# Altium project Arduino_Project_Altium.PrjPcb
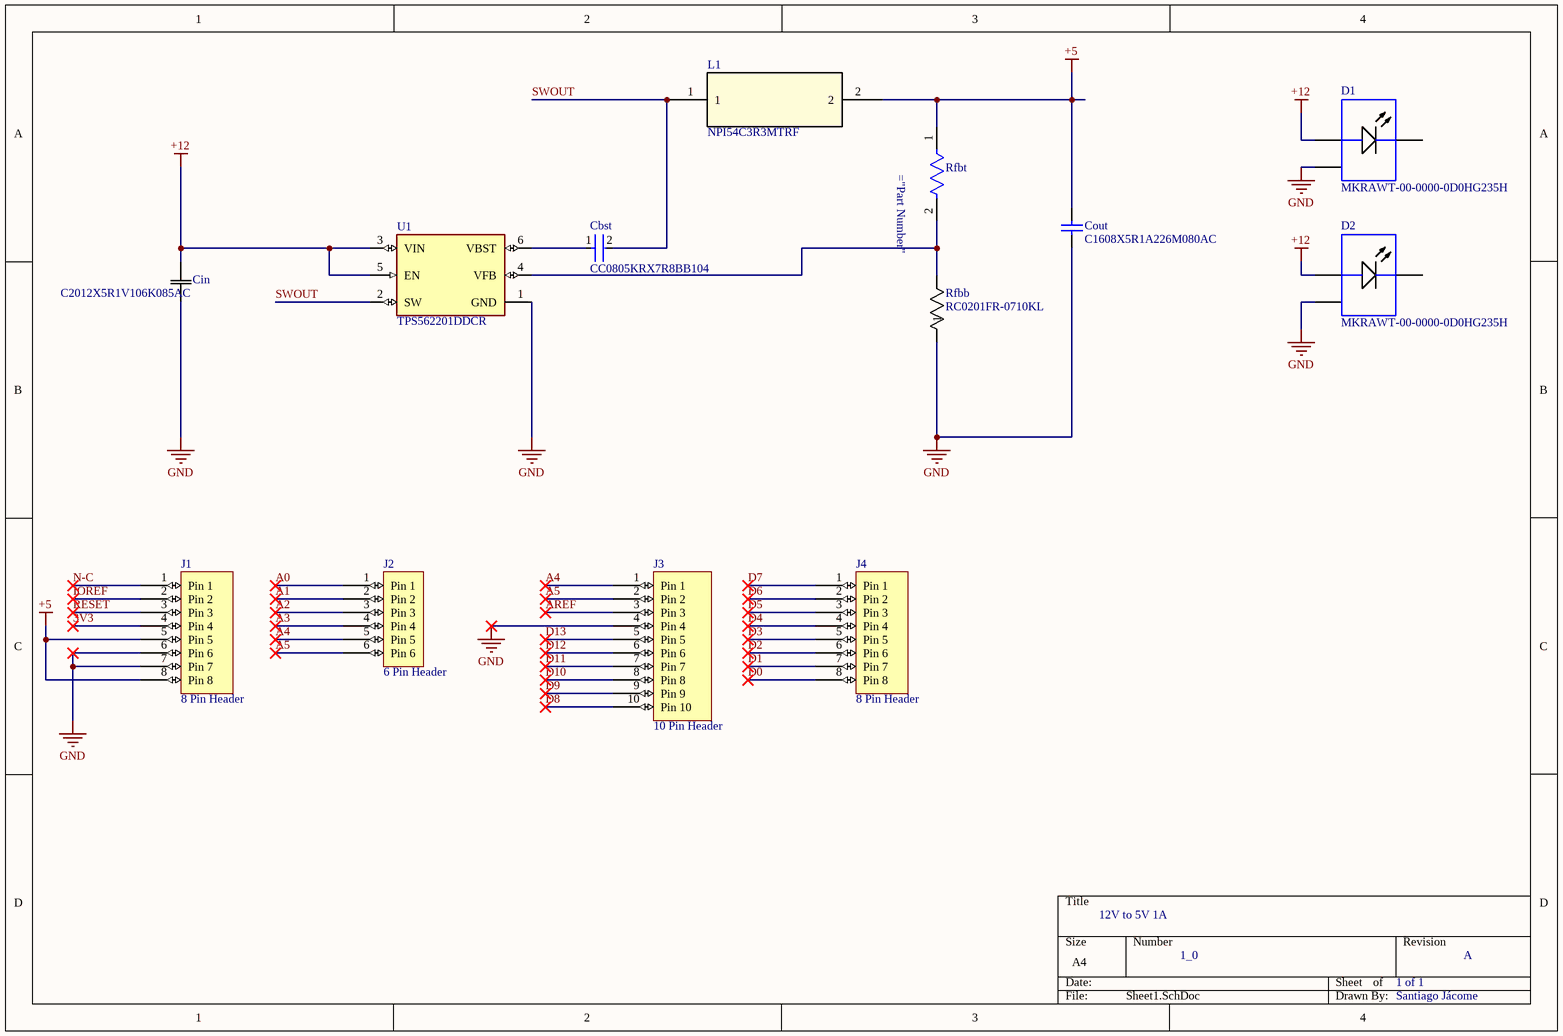
[diagram p0: Sheet1.SchDoc]
1 sheet, 13 parts. Net scope: global (net labels, ports and power ports of the same name join across sheets).
Board file: PCB_Full.PcbDoc

## Sheet Sheet1.SchDoc
size A4; SheetNumber: 1; SheetTotal: 1

### Parts
Cbst  CC0805KRX7R8BB104  [FP-CC0805-0_85-MFG]
Cin  C2012X5R1V106K085AC  [CAP_2012_TDK-M]
Cout  C1608X5R1A226M080AC  [CAPC1608X100X20ML10]
D1  MKRAWT-00-0000-0D0HG235H  [CREE-MK-R-2_V]
D2  MKRAWT-00-0000-0D0HG235H  [CREE-MK-R-2_V]
J1  8 Pin Header  [8 Pin Header-Footprint-1]
J2  6 Pin Header  [6 Pin Header-Footprint-1]
J3  10 Pin Header  [10 Pin Header-Footprint-1]
J4  8 Pin Header  [8 Pin Header-Footprint-1]
L1  NPI54C3R3MTRF  [NPI54C3R3MTRF_NIC]
Rfbb  RC0201FR-0710KL  [YAG_R0201_YAG-L]
Rfbt  RC0201FR-0756K2L  [Yageo_RC0201_MFG]  (value not drawn)
U1  TPS562201DDCR  [FP-DDC0006A-IPC_C]

### Nets
+5: Cout.2 J1.5(Pin_5) J1.8(Pin_8) L1.2 Rfbt.1
+12: Cin.2 D1.1(A) D2.1(A) U1.3(VIN) U1.5(EN)
GND: Cin.1 Cout.1 D1.3(EP) D2.3(EP) J1.6(Pin_6) J1.7(Pin_7) J3.4(Pin_4) Rfbb.1 U1.1(GND)
3V3: J1.4(Pin_4)
A0: J2.1(Pin_1)
A1: J2.2(Pin_2)
A2: J2.3(Pin_3)
A3: J2.4(Pin_4)
A4: J2.5(Pin_5) J3.1(Pin_1)
A5: J2.6(Pin_6) J3.2(Pin_2)
AREF: J3.3(Pin_3)
D0: J4.8(Pin_8)
D1: J4.7(Pin_7)
D2: J4.6(Pin_6)
D3: J4.5(Pin_5)
D4: J4.4(Pin_4)
D5: J4.3(Pin_3)
D6: J4.2(Pin_2)
D7: J4.1(Pin_1)
D8: J3.10(Pin_10)
D9: J3.9(Pin_9)
D10: J3.8(Pin_8)
D11: J3.7(Pin_7)
D12: J3.6(Pin_6)
D13: J3.5(Pin_5)
IOREF: J1.2(Pin_2)
N-C: J1.1(Pin_1)
RESET: J1.3(Pin_3)
SWOUT: Cbst.2 L1.1 U1.2(SW)
NetCbst_1: Cbst.1 U1.6(VBST)
NetRfbb_2: Rfbb.2 Rfbt.2 U1.4(VFB)

Not connected (* = marked no-connect by the designer): D1 2(K); D2 2(K)

### Notes on the sheet
- 12V to 5V 1A
- 1_0
- 1 of 1
- A
- Santiago Jácome

### Library data of the parts
Cbst = CMP-1036-04410-2: CAP CER 0.1UF 25V X7R 0805; Manufacturer: Yageo; Tolerance: 0.1; Value: 100 nF; ComponentLink2URL: http://www.yageo.com/documents/recent/UPY-GPHC_Y5V_6.3V-to-50V_8.pdf; Category: Cap; Mouser Description: Multilayer Ceramic Capacitors MLCC - SMD/SMT 100nF 25V X7R 10%; Manufacturer Part Number: CC0805KRX7R8BB104; Device Class L1: Passive Components; Footprint Url: http://www.yageo.com/exep/pages/download/literatures/UPY-C_GEN_24.pdf; Height: 0.95mm; Material: Ceramic; Digikey Description: CAP CER 0.1UF 25V X7R 0805; Lead Free: Yes; Temperature Range High: +85°C; Temperature: -30°C to +85°C; Ipc Land Pattern Name: CAPC200125X85; Capacitance: 100 nF; Automotive: No; Octopart: https://octopart.com/cc0805krx7r8bb104-yageo-39467766; Device Class L2: Capacitors; Temperature Characteristic: X7R; Voltage Rating: 25 V; ComponentLink2Description: Datasheet; Temperature Range Low: -30°C; Device Class L3: Ceramic Capacitors; RoHS: TRUE; Package: CC0805-0.85
Cin = C2012X5R1V106K085AC: 10uf; Mfr_Name: TDK
Cout = CMP-2000-05441-1: Chip Capacitor, 22 uF, +/- 20%, 10 V, -55 to 85 degC, 0603 (1608 Metric), RoHS, Tape and Reel; Manufacturer: TDK; PCN Part Number: MLCCPartNumberChange30/Nov/2012; Voltage - Rated: 10V; Product Training Modules: CSeriesGeneralApplicationsSEAT,CCV,andTVCLDesignToolsGuidetoReplacinganElectrolyticCapacitorwithanMLCC; Other Names: 445-9077-1; Design Resources: 20WNon-IsolatedBuckLEDDriverUsingPLLNK460KG; Online Catalog: CSeries,GeneralPurpose; Capacitance: 22µF; Temperature Coefficient: X5R; Kits: 445-9014-KIT-ND-KITMLCC100PF-22UF060310-50V; Packaging: CutTape(CT); Standard Package: 1; Package / Case: 0603(1608Metric); Lead Style: -; Features: -; Ratings: -; Operating Temperature: -55degC~85degC; Applications: GeneralPurpose; Package Reference: 603; Datasheet URL: http://download.siliconexpert.com/pdfs/2015/4/21/15/54/45/779/tdk_/manual/37024850441143360mlcc_commercial_general_en.pdf; Datasheet Version: Mar-15; Mounting Type: SurfaceMount,MLCC; Lead Spacing: -; Size / Dimension: 0.063"Lx0.031"W(1.60mmx0.80mm); Height - Seated (Max): -; Package Description: 2-Pin Surface Mount Device, Body 1.6 x 0.8 mm; Manufacturer URL: http://www.tdk.com/; RoHS Information: RoHSCertificate-MLCC; Tolerance: ±20%; Series: C; Thickness (Max): 0.035"(0.90mm); Family: CeramicCapacitors; Category: Capacitors
D1 D2 = CMP-2100-00977-1: LED, White, 12 V, 2-Pin SMD, RoHS, Tape and Reel
J1 J4 = CMP-002-00071-1: Arduino 8 Pin Header: 30 mils hole diameter, 60 mils pad diameter, 100 mils pin-to-pin
J2 = ARDUINO-6PIN-HEADER-1: Arduino 6 Pin Header: 30 mils hole diameter, 60 mils pad diameter, 100 mils pin-to-pin
J3 = CMP-002-00072-1: Arduino 10 Pin Header: 30 mils hole diameter, 60 mils pad diameter, 100 mils pin-to-pin
L1 = NPI54C3R3MTRF: No Description Available; Mfr_Name: NIC Components Corp.; RefDes: RefDes; Type: Type
Rfbb = RC0201FR-0710KL: 10k Ohms; Mfr_Name: Yageo
Rfbt = RC0201FR-0756K2L: 56.2k Ohms
U1 = CMP-04918-000361-1: IC REG BUCK ADJ 2A TSOT23-6; Switching Frequency: 580kHz; Max Input Voltage: 17V; Number of Outputs: 1; Output Voltage: 7V; Output Type: Adjustable; Quiescent Current: 400uA; Min Input Voltage: 4.5V; Mount: Surface Mount; Max Operating Temperature: 125°C; Lead Free: Lead Free; Operating Supply Voltage: 17V; Number of Pins: 6; RoHS Compliant: Yes; Contact Plating: Tin; Min Operating Temperature: -40°C; Case/Package: SOT; Max Output Current: 2A